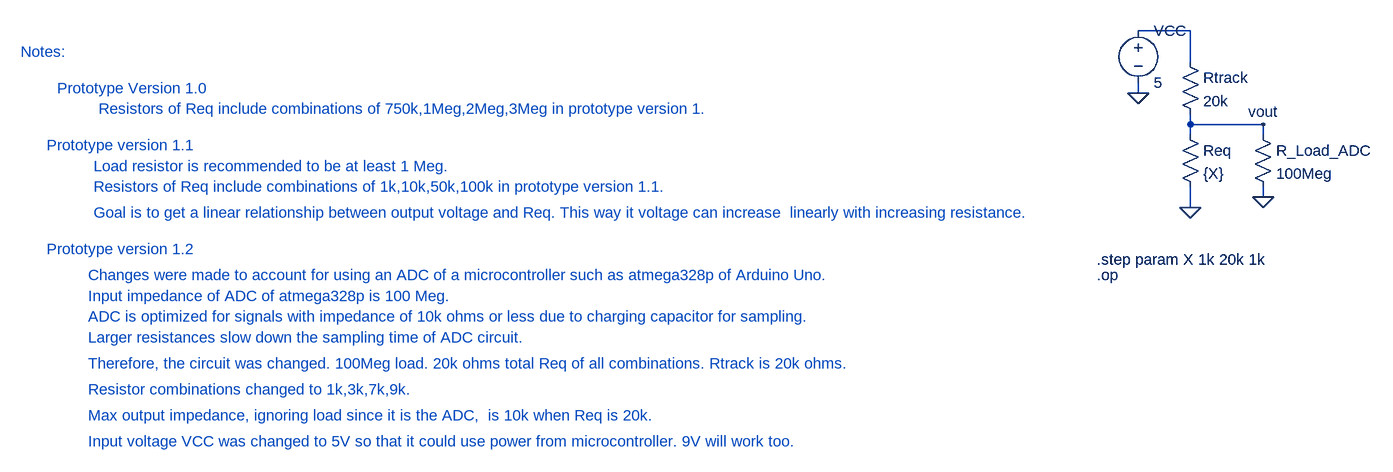
[diagram p0: schematic ltspice-sim-with-load.asc]
ltspice-sim-with-load.asc, the LTspice schematic file:
Version 4
SHEET 1 880 680
WIRE 48 -16 -32 -16
WIRE 48 32 48 -16
WIRE -32 80 -32 64
WIRE 48 128 48 112
WIRE 160 128 48 128
WIRE 48 144 48 128
WIRE 160 144 160 128
WIRE 160 240 160 224
WIRE 48 256 48 224
FLAG 48 256 0
FLAG -32 80 0
FLAG 160 240 0
FLAG 160 128 vout
SYMBOL res 32 128 R0
SYMATTR InstName Req
SYMATTR Value {X}
SYMBOL res 32 16 R0
SYMATTR InstName Rtrack
SYMATTR Value 20k
SYMBOL voltage -32 -32 R0
WINDOW 123 0 0 Left 0
WINDOW 39 0 0 Left 0
SYMATTR InstName VCC
SYMATTR Value 5
SYMBOL res 144 128 R0
SYMATTR InstName R_Load_ADC
SYMATTR Value 100Meg
TEXT -96 336 Left 2 !.step param X 1k 20k 1k
TEXT -96 360 Left 2 !.op
TEXT -1632 104 Left 2 ;Resistors of Req include combinations of 750k,1Meg,2Meg,3Meg in prototype version 1.
TEXT -1752 16 Left 2 ;Notes:
TEXT -1640 192 Left 2 ;Load resistor is recommended to be at least 1 Meg.
TEXT -1640 224 Left 2 ;Resistors of Req include combinations of 1k,10k,50k,100k in prototype version 1.1.
TEXT -1640 264 Left 2 ;Goal is to get a linear relationship between output voltage and Req. This way it voltage can increase  linearly with increasing resistance.
TEXT -1712 320 Left 2 ;Prototype version 1.2
TEXT -1648 360 Left 2 ;Changes were made to account for using an ADC of a microcontroller such as atmega328p of Arduino Uno.
TEXT -1712 160 Left 2 ;Prototype version 1.1
TEXT -1696 72 Left 2 ;Prototype Version 1.0
TEXT -1648 392 Left 2 ;Input impedance of ADC of atmega328p is 100 Meg.
TEXT -1648 424 Left 2 ;ADC is optimized for signals with impedance of 10k ohms or less due to charging capacitor for sampling.
TEXT -1648 456 Left 2 ;Larger resistances slow down the sampling time of ADC circuit.
TEXT -1648 496 Left 2 ;Therefore, the circuit was changed. 100Meg load. 20k ohms total Req of all combinations. Rtrack is 20k ohms.
TEXT -1648 536 Left 2 ;Resistor combinations changed to 1k,3k,7k,9k.
TEXT -1648 576 Left 2 ;Max output impedance, ignoring load since it is the ADC,  is 10k when Req is 20k.
TEXT -1648 616 Left 2 ;Input voltage VCC was changed to 5V so that it could use power from microcontroller. 9V will work too.

The netlist it stands for:
* ltspice-sim-with-load.asc
Req vout 0 {X}
Rtrack N001 vout 20k
VCC N001 0 5
R_Load_ADC vout 0 100Meg
.step param X 1k 20k 1k
.op
* Resistors of Req include combinations of 750k,1Meg,2Meg,3Meg in prototype version 1.
* Notes:
* Load resistor is recommended to be at least 1 Meg.
* Resistors of Req include combinations of 1k,10k,50k,100k in prototype version 1.1.
* Goal is to get a linear relationship between output voltage and Req. This way it voltage can increase  linearly with increasing resistance.
* Prototype version 1.2
* Changes were made to account for using an ADC of a microcontroller such as atmega328p of Arduino Uno.
* Prototype version 1.1
* Prototype Version 1.0
* Input impedance of ADC of atmega328p is 100 Meg.
* ADC is optimized for signals with impedance of 10k ohms or less due to charging capacitor for sampling.
* Larger resistances slow down the sampling time of ADC circuit.
* Therefore, the circuit was changed. 100Meg load. 20k ohms total Req of all combinations. Rtrack is 20k ohms.
* Resistor combinations changed to 1k,3k,7k,9k.
* Max output impedance, ignoring load since it is the ADC,  is 10k when Req is 20k.
* Input voltage VCC was changed to 5V so that it could use power from microcontroller. 9V will work too.
.backanno
.end

* Results of the author's LTspice run, read from the files saved beside the schematic
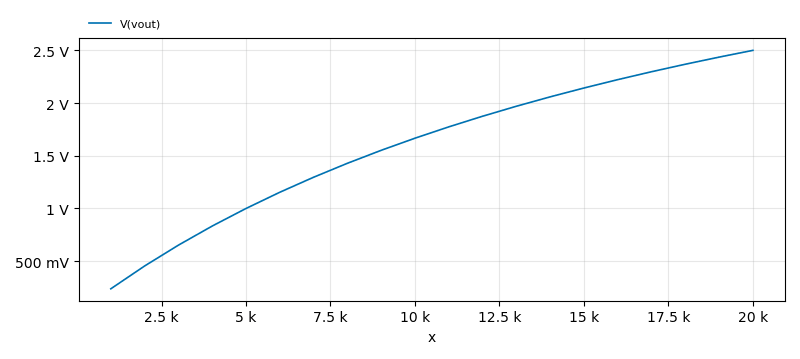
[diagram p1: Operating Point of ltspice-sim-with-load.asc, plotted from the saved traces]
* Operating Point, 1 run:
*   V(vout): 238.1 mV at x=1 k, 2.5 V at x=20 k, min 238.1 mV, max 2.5 V